# EAGLE design dmx-relay-puck (EAGLE 7.4.0)
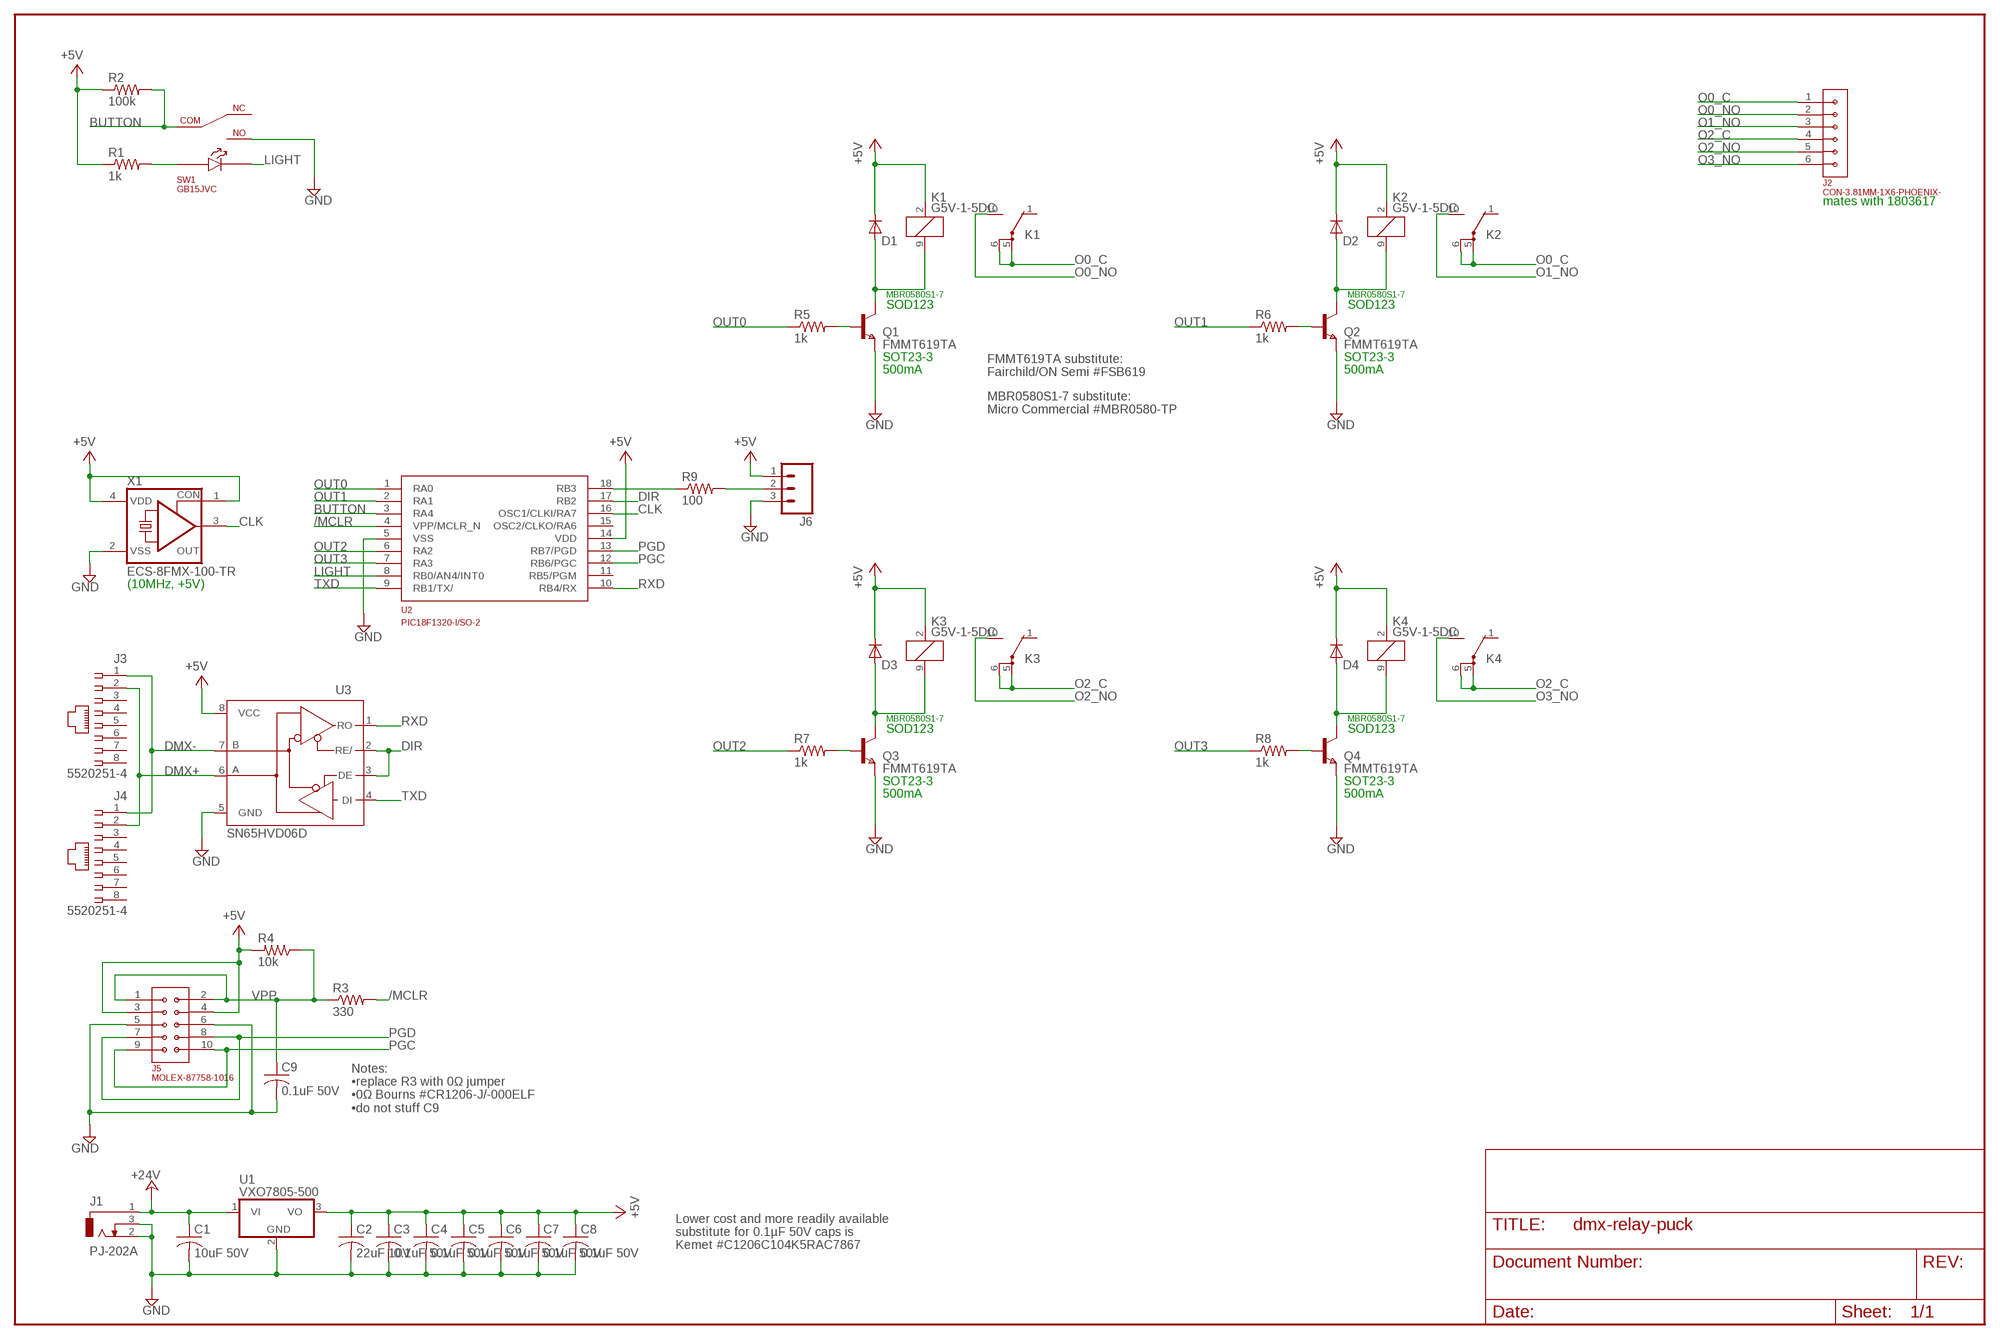
[diagram p0: schematic, sheet 1]

## Parts
C1  10uF 50V  C-USC1210K  [C1210K]
C2  22uF 10V  C-USC1206K  [C1206K]
C3  0.1uF 50V  C-USC1206K  [C1206K]
C4  0.1uF 50V  C-USC1206K  [C1206K]
C5  0.1uF 50V  C-USC1206K  [C1206K]
C6  0.1uF 50V  C-USC1206K  [C1206K]
C7  0.1uF 50V  C-USC1206K  [C1206K]
C8  0.1uF 50V  C-USC1206K  [C1206K]
C9  0.1uF 50V  C-USC1206K  [C1206K]
D1  1N4148W-TP  DIODE-SOD123  [SOD123]
D2  1N4148W-TP  DIODE-SOD123  [SOD123]
D3  1N4148W-TP  DIODE-SOD123  [SOD123]
D4  1N4148W-TP  DIODE-SOD123  [SOD123]
J1  PJ-202A  DCJ0202  [DCJ0202]
J2  CON-3.81MM-1X6-PHOENIX-  [CON-PHOENIX-3.81-1X6]
J3  5520251-4  520251-4  [520251-4]
J4  5520251-4  520251-4  [520251-4]
J5  MOLEX-87758-1016  CON-2MM-2X5-MOLEX-87758-1016  [CON-2MM-2X5]
J6  M03PTH  [1X03]
K1  G5V-1-5DC  G5V1  [G5V1]
K2  G5V-1-5DC  G5V1  [G5V1]
K3  G5V-1-5DC  G5V1  [G5V1]
K4  G5V-1-5DC  G5V1  [G5V1]
Q1  FMMT619TA  NPNSOT23  [SOT-23]
Q2  FMMT619TA  NPNSOT23  [SOT-23]
Q3  FMMT619TA  NPNSOT23  [SOT-23]
Q4  FMMT619TA  NPNSOT23  [SOT-23]
R1  1k  R-US_R1206  [R1206]
R2  100k  R-US_R1206  [R1206]
R3  330  R-US_R1206  [R1206]
R4  10k  R-US_R1206  [R1206]
R5  1k  R-US_R1206  [R1206]
R6  1k  R-US_R1206  [R1206]
R7  1k  R-US_R1206  [R1206]
R8  1k  R-US_R1206  [R1206]
R9  100  R-US_R1206  [R1206]
SW1  GB15JVC  GB15JHC  [GB15JHC]
U1  VXO7805-500  CUI-V7803-500  [CUI-78XX-500]
U2  PIC18F1320-I/SO-2  [SO18W]
U3  SN65HVD06D  MAX3468CSA  [SO08]
X1  ECS-8FMX-100-TR  CRYSTAL_RES-1100S  [1100S]

## Nets
+5V: C2.1 C3.1 C4.1 C5.1 C6.1 C7.1 C8.1 D1.C D2.C D3.C D4.C J5.3 J5.4 J6.1 K1.2 K2.2 K3.2 K4.2 R1.1 R2.1 R4.2 U1.3(VO) U2.14(VDD) U3.8(VCC) X1.1(CON) X1.4(VDD)
+24V: C1.1 J1.1 U1.1(VI)
/MCLR: R3.2 U2.4(VPP/MCLR_N)
BUTTON: R2.2 SW1.5 U2.3(RA4)
CLK: U2.16(OSC1/CLKI/RA7) X1.3(OUT)
DIR: U2.17(RB2) U3.2(RE/) U3.3(DE)
DMX+: J3.2 J4.2 U3.6(A)
DMX-: J3.1 J4.1 U3.7(B)
GND: C1.2 C2.2 C3.2 C4.2 C5.2 C6.2 C7.2 C8.2 C9.2 J1.2 J1.3 J5.5 J5.6 J6.3 Q1.2(E) Q2.2(E) Q3.2(E) Q4.2(E) SW1.4 U1.2(GND) U2.5(VSS) U3.5(GND) X1.2(VSS)
LIGHT: SW1.3 U2.8(RB0/AN4/INT0)
N$1: Q2.3(B) R6.2
N$2: D2.A K2.9 Q2.1(C)
N$3: Q3.3(B) R7.2
N$4: D3.A K3.9 Q3.1(C)
N$5: Q4.3(B) R8.2
N$6: D4.A K4.9 Q4.1(C)
N$8: R9.1 U2.18(RB3)
N$9: J6.2 R9.2
N$14: R1.2 SW1.1
N$16: Q1.3(B) R5.2
N$200: D1.A K1.9 Q1.1(C)
O0_C: J2.1 K1.5(2:P) K1.6(2:P) K2.5(2:P) K2.6(2:P)
O0_NO: J2.2 K1.10(2:S)
O1_NO: J2.3 K2.10(2:S)
O2_C: J2.4 K3.5(2:P) K3.6(2:P) K4.5(2:P) K4.6(2:P)
O2_NO: J2.5 K3.10(2:S)
O3_NO: J2.6 K4.10(2:S)
OUT0: R5.1 U2.1(RA0)
OUT1: R6.1 U2.2(RA1)
OUT2: R7.1 U2.6(RA2)
OUT3: R8.1 U2.7(RA3)
PGC: J5.9 J5.10 U2.12(RB6/PGC)
PGD: J5.7 J5.8 U2.13(RB7/PGD)
RXD: U2.10(RB4/RX) U3.1(RO)
TXD: U2.9(RB1/TX/) U3.4(DI)
VPP: C9.1 J5.1 J5.2 R3.1 R4.1
Unconnected: J3.3 J3.4 J3.5 J3.6 J3.7 J3.8 J4.3 J4.4 J4.5 J4.6 J4.7 J4.8 K1.1(2:O) K2.1(2:O) K3.1(2:O) K4.1(2:O) SW1.6 U2.11(RB5/PGM) U2.15(OSC2/CLKO/RA6)

## Notes on the sheet
- mates with 1803617
- MBR0580S1-7 | MBR0580S1-7
- SOD123 | SOD123
- SOT23-3 | SOT23-3
- 500mA | 500mA
- FMMT619TA substitute:
  Fairchild/ON Semi #FSB619
- MBR0580S1-7 substitute:
  Micro Commercial #MBR0580-TP
- (10MHz, +5V)
- MBR0580S1-7 | MBR0580S1-7
- SOD123 | SOD123
- SOT23-3 | SOT23-3
- 500mA | 500mA
- Notes:
  •replace R3 with 0Ω jumper
  •0Ω Bourns #CR1206-J/-000ELF
  •do not stuff C9
- Lower cost and more readily available
  substitute for 0.1µF 50V caps is
  Kemet #C1206C104K5RAC7867

## Library data of the parts
C1 = rcl:C-US: CAPACITOR, American symbol; MFR: KEMET; MFR_PART_NO: C1210C106K5RACTU
C2 = rcl:C-US: CAPACITOR, American symbol; MFR: KEMET; MFR_PART_NO: C1206C226K8RAC7800
C3-C9 = rcl:C-US: CAPACITOR, American symbol; MFR: KEMET; MFR_PART_NO: C1206S104M5RACTU
D1-D4 = diode:DIODE-: DIODE; MFR: DIODES INC; MFR_PART_NO: MBR0580S1-7
J1 = GlenPartsLibrary:DCJ0202: DC POWER JACK Source: DCJ0202.pdf; MFR: CUI; MFR_PART_NO: PJ-202A
J2 = 0GlenConnectors:CON-3.81MM-1X6-PHOENIX-; MFR: PHOENIX; MFR_PART_NO: 1803316
J3 J4 = con-amp:520251-4: AMP connector; MFR: TE; MFR_PART_NO: 5520251-4
J5 = 0GlenConnectors:CON-2MM-2X5-MOLEX-87758-1016; MFR: MOLEX; MFR_PART_NO: 87758-1016
J6 = SparkFun:M03: Header 3 Standard 3-pin 0.1" header. Use with straight break away headers (SKU : PRT-00116), right angle break away headers (PRT-00553), swiss pins (PRT-00743), machine pins (PRT-00117), and female headers (PRT-00115). Molex polarized connector foot print use with SKU : PRT-08232 with associated crimp pins and housings.; MFR: WURTH; MFR_PART_NO: 61300311121
K1-K4 = relay:G5V1: RELAY 1 x switch, 0.5 A/125 V AC, 1 A/24 V DC , Omron; MFR: OMRON; MFR_PART_NO: G5V-1-DC5; MPN: G5V-1-DC24; OC_FARNELL: 9949593; OC_NEWARK: 36M6377
Q1-Q4 = zetex:NPNSOT23: NPN TRANSISTOR; MFR: DIODES INC; MFR_PART_NO: FMMT619TA; MPN: DSS20201L-7; OC_FARNELL: 1710688; OC_NEWARK: 25R4555
R1 = rcl:R-US_: RESISTOR, American symbol; MFR: BOURNS; MFR_PART_NO: CR1206-JW-102GLF
R2 = rcl:R-US_: RESISTOR, American symbol; MFR: BOURNS; MFR_PART_NO: CR1206-JW-104GLF
R3 = rcl:R-US_: RESISTOR, American symbol; MFR: BOURNS; MFR_PART_NO: CR1206-JW-331ELF
R4 = rcl:R-US_: RESISTOR, American symbol; MFR: BOURNS; MFR_PART_NO: CR1206-JW-103GLF
R5-R8 = rcl:R-US_: RESISTOR, American symbol; MFR: BOURNS; MFR_PART_NO: CR1206-JW-102ELF
R9 = rcl:R-US_: RESISTOR, American symbol; MFR: BOURNS; MFR_PART_NO: CR1206-JW-101ELF
SW1 = GlenPartsLibrary:GB15JHC; MFR: NKK; MFR_PART_NO: GB15JVC
U1 = GlenPartsLibrary:CUI-V7803-500; MFR: CUI; MFR_PART_NO: VXO7805-500
U2 = GlenPartsLibrary:PIC18F1320-I/SO-2; MFR: MICROCHIP; MFR_PART_NO: PIC18F1320-I/SO
U3 = maxim:MAX34*: +5V, Fail-Safe, 40Mbps, Profibus RS-485/RS-422 Transceivers Source: MAX3465-MAX3469.pdf; MFR: TI; MFR_PART_NO: SN65HVD06D; MPN: MAX3468CSA+; OC_FARNELL: unknown; OC_NEWARK: 76K6721
X1 = crystal:CRYSTAL_RES-: CRYSTAL RESONATOR; MFR: ECS; MFR_PART_NO: ECS-8FMX-100-TR; OC_FARNELL: unknown; OC_NEWARK: unknown

## Board
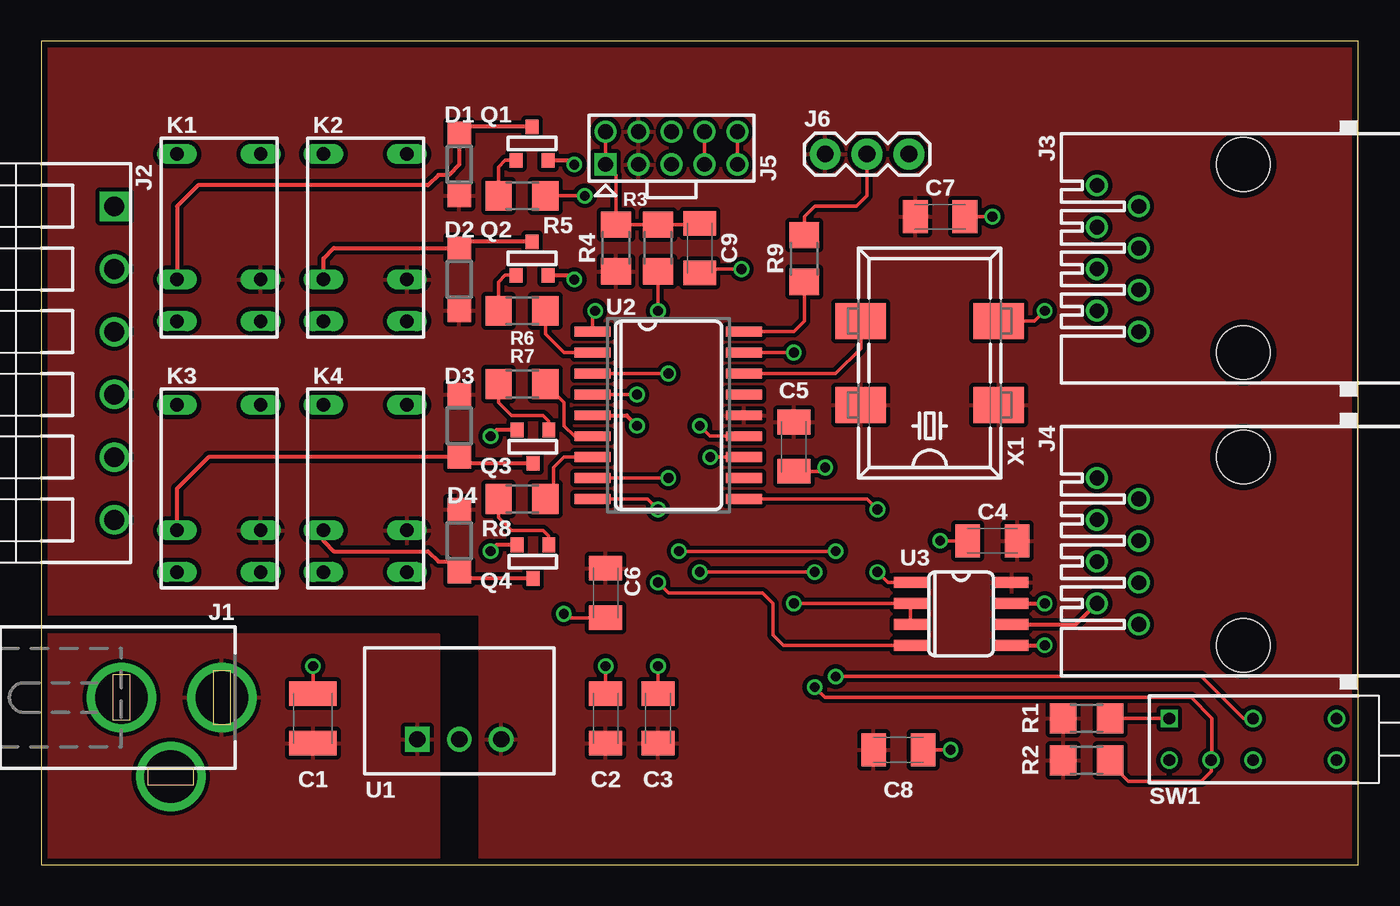
[diagram p1: board, top side]
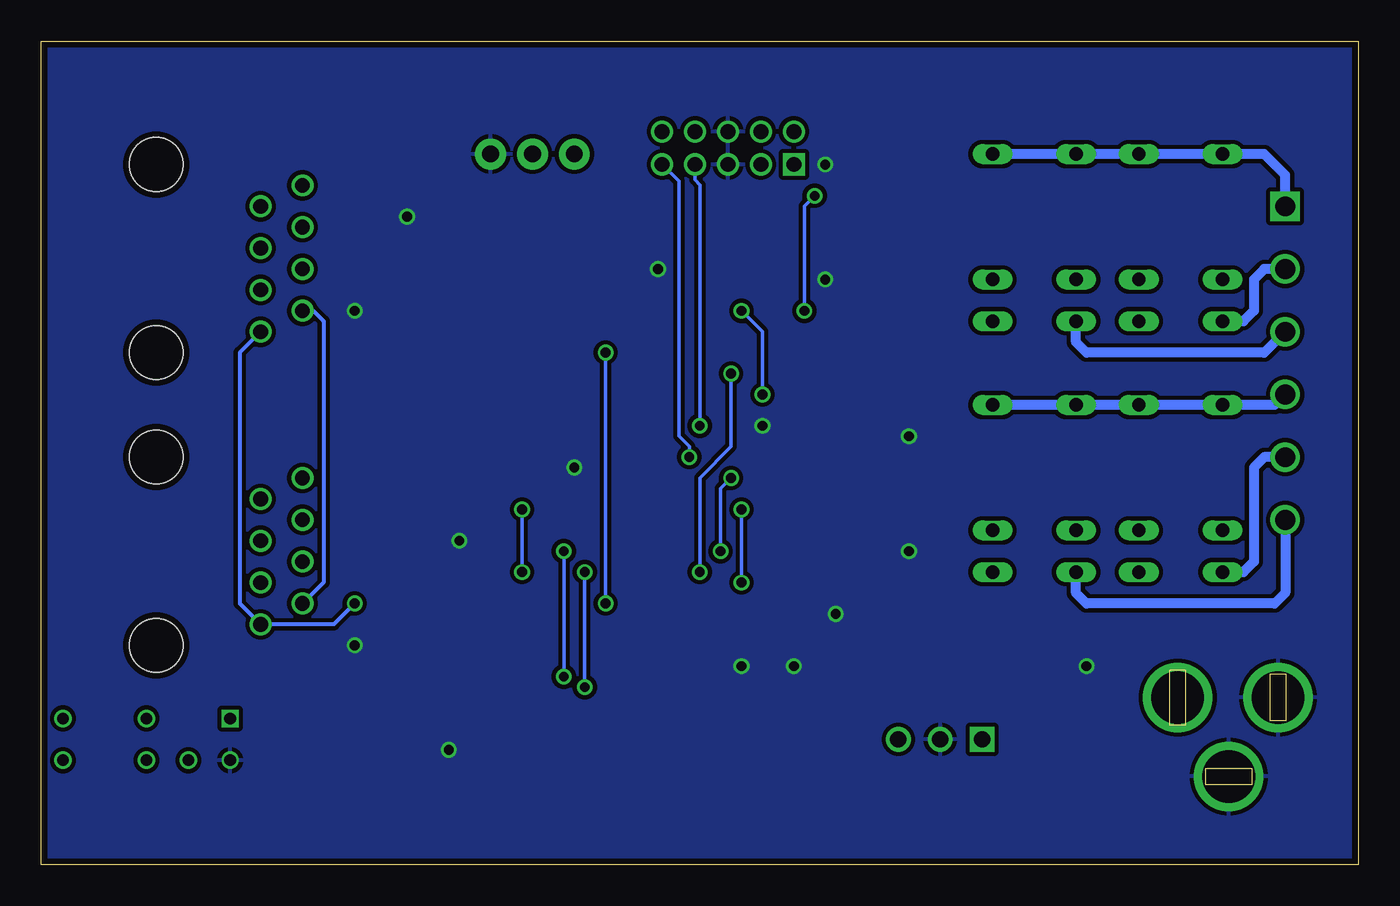
[diagram p2: board, bottom side, seen from below]

Size 80.01 x 50.04 mm. Coordinates in mm from the lower left corner, seen from the top.
Outline: 0,0 80.01,0 80.01,50.04 0,50.04 0,0
Copper layers (1*16): Top 0.0356mm / dielectric 1.5011mm / Bottom 0.0356mm
Design rules "LaenPCBOrder": minimum track width 6mil, minimum drill 13mil, track to track 6mil, track to pad 6mil, pad to pad 6mil, via to via 6mil, smd to smd 6mil, copper to edge 15mil, drill to drill 6mil, minimum pad ring 7mil, minimum via ring 7mil, stop-mask expansion 4mil, vias tented up to drill 0mil, thermal gap 10mil

### Footprints (pad centres in the part's own frame; a part is rotated, then mirrored left to right if it is on the bottom)
C1210K = smd 1.5 x 2.9: 1 -1.5,0; 2 1.5,0
C1206K = smd 1.5 x 2: 1 -1.5,0; 2 1.5,0
SOD123 = smd 1.4 x 1.4: A 1.9,0; C -1.9,0
DCJ0202 = drill 3.2 pad 4.064: 1 0,3.1; 2 0,-3; 3 4.8,0
CON-PHOENIX-3.81-1X6 = drill 1.2 square: 1 0,0 | drill 1.2: 2 3.81,0; 3 7.62,0; 4 11.43,0; 5 15.24,0; 6 19.05,0
520251-4 = drill 0.889: 1 -4.445,6.35; 2 -3.175,8.89; 3 -1.905,6.35; 4 -0.635,8.89; 5 0.635,6.35; 6 1.905,8.89; 7 3.175,6.35; 8 4.445,8.89 | hole 3.251: -5.715,0; 5.715,0
CON-2MM-2X5 = drill 0.9 pad 1.27 square: 1 0,0 | drill 0.9 pad 1.27: 2 2,0; 3 0,-2; 4 2,-2; 5 0,-4; 6 2,-4; 7 0,-6; 8 2,-6; 9 0,-8; 10 2,-8
1X03 = drill 1.016 pad 1.88: 1 0,0; 2 2.54,0; 3 5.08,0
G5V1 = drill 0.813 long: 1 -5.08,-2.54; 2 -2.54,-2.54; 5 5.08,-2.54; 6 5.08,2.54; 9 -2.54,2.54; 10 -5.08,2.54
SOT-23 = smd 0.787 x 0.889: 1 0.025,-1.016; 2 -0.94,1.016; 3 0.991,1.016
R1206 = smd 1.6 x 1.803: 1 -1.422,0; 2 1.422,0
GB15JHC = drill 0.7 square: 1 1.27,12.751 | drill 0.7: 3 1.27,7.671; 4 -1.27,12.751; 5 -1.27,10.211; 6 -1.27,7.671; NC.1 1.27,2.591; NC.2 -1.27,2.591
CUI-78XX-500 = drill 1 square: 1 0,0 | drill 1: 2 2.54,0; 3 5.08,0
SO18W = smd 0.6 x 2.2: 1 -4.445,-4.6; 2 -3.175,-4.6; 3 -1.905,-4.6; 4 -0.635,-4.6; 5 0.635,-4.6; 6 1.905,-4.6; 7 3.175,-4.6; 8 4.445,-4.6; 9 5.715,-4.6; 10 5.715,4.6; 11 4.445,4.6; 12 3.175,4.6; 13 1.905,4.6; 14 0.635,4.6; 15 -0.635,4.6; 16 -1.905,4.6; 17 -3.175,4.6; 18 -4.445,4.6
SO08 = smd 0.66 x 2.032: 1 -1.905,-3.073; 2 -0.635,-3.073; 3 0.635,-3.073; 4 1.905,-3.073; 5 1.905,3.073; 6 0.635,3.073; 7 -0.635,3.073; 8 -1.905,3.073
1100S = smd 2.184 x 3.048: 1 -2.54,-4.191; 2 2.54,-4.191; 3 2.54,4.191; 4 -2.54,4.191

### Placement (x,y rotation side)
C1  16.51,8.89 90 top
C2  34.29,8.89 90 top
C3  37.47,8.89 90 top
C4  57.78,19.68 180 top
C5  45.72,25.4 270 top
C6  34.29,16.51 270 top
C7  54.61,39.37 0 top
C8  52.07,6.99 0 top
C9  40.01,37.47 270 top
D1  25.4,42.55 90 top
D2  25.4,35.56 90 top
D3  25.4,26.67 270 top
D4  25.4,19.68 270 top
J1  7.87,10.16 270 top
J2  4.45,40.01 270 top
J3  73.03,36.83 90 top
J4  73.03,19.05 90 top
J5  34.29,42.55 90 top
J6  47.62,43.18 0 top
K1  10.79,38.1 90 top
K2  19.68,38.1 90 top
K3  10.79,22.86 90 top
K4  19.68,22.86 90 top
Q1  29.84,43.81 180 top
Q2  29.84,36.83 180 top
Q3  29.84,25.4 0 top
Q4  29.84,18.41 0 top
R1  63.5,8.89 0 top
R2  63.5,6.35 0 top
R3  37.47,37.47 270 top
R4  34.92,37.47 270 top
R5  29.21,40.64 180 top
R6  29.21,33.66 180 top
R7  29.21,29.21 180 top
R8  29.21,22.23 180 top
R9  46.35,36.83 90 top
SW1  81.28,7.62 90 top
U1  22.86,7.62 0 top
U2  38.1,27.94 270 top
U3  55.88,15.24 270 top
X1  53.98,30.48 90 top

### Tracks (layer width: path | path; a pad name or v marks a point on that pad's centre or on a via)
+5V
  pour Top (isolate 0.254): 26.67,0 26.67,15.24 0,15.24 0,50.04 80.01,50.04 80.01,0
+24V
  pour Top (isolate 0.254): 0,0 0,13.97 24.13,13.97 24.13,0
/MCLR  (via drill 0.6)
  Top 0.203: U2.4 v36.2,28.57 | v37.47,33.66 R3.2
  Bottom 0.203: v36.2,28.57 36.2,32.38 v37.47,33.66
BUTTON  (via drill 0.6)
  Top 0.203: U2.3 v38.1,29.84 | v40.01,17.78 v46.99,17.78 | v46.99,10.79 47.62,10.16 69.85,10.16 71.12,8.89 71.12,6.4 SW1.5 71.07,5.66 70.48,5.08 66.04,5.08 65.41,5.71 65.41,5.87 R2.2
  Bottom 0.203: v38.1,29.84 38.1,25.4 40.01,23.5 v40.01,17.78 | v46.99,17.78 v46.99,10.79
CLK
  Top 0.203: U2.16 48.26,29.84 49.78,31.37 X1.3
DIR  (via drill 0.6)
  Top 0.203: U3.3 U3.2 v45.72,15.88 | v45.72,31.11 U2.17
  Bottom 0.203: v45.72,15.88 v45.72,31.11
DMX+
  Top 0.254: U3.6 62.87,14.61 J4.2
  Bottom 0.254: J3.2 63.5,33.66 62.87,33.02 62.87,17.14 J4.2
DMX-  (via drill 0.6)
  Top 0.254: U3.7 v60.96,15.88
  Bottom 0.254: J3.1 67.94,31.11 67.94,15.88 J4.1 62.23,14.61 v60.96,15.88
GND  (via drill 0.6)
  Top 0.203: C5.2 47.4,23.9 v47.62,24.13 | C4.2 v54.61,19.68 | X1.2 60.33,33.02 v60.96,33.66 | C1.2 v16.51,12.06 | C2.2 v34.29,12.06 | C3.2 v37.47,12.06 | C9.2 40.01,36.2 v42.55,36.2 | C6.2 31.98,15.01 v31.75,15.24 | C7.2 v57.78,39.37 | C8.2 v55.24,6.99
  Top 0.254: U2.5 35.56,27.3 v36.2,26.67 | U3.5 v60.96,13.34 | Q1.2 32.13,42.8 v32.38,42.55 | Q2.2 32.13,35.81 v32.38,35.56 | Q3.2 27.69,26.42 v27.3,26.04 | Q4.2 27.69,19.43 v27.3,19.05
  pour Bottom (isolate 0.254): 0,0 80.01,0 80.01,50.04 0,50.04
LIGHT  (via drill 0.6)
  Top 0.203: U2.8 v38.1,23.5 | v38.73,19.05 v48.26,19.05 | SW1.3 73.03,8.89 70.48,11.43 v48.26,11.43
  Bottom 0.203: v38.1,23.5 38.73,22.86 v38.73,19.05 | v48.26,19.05 v48.26,11.43
N$1
  Top 0.203: R6.2 27.79,35.41 28.19,35.81 Q2.3
N$2
  Top 0.203: D2.A
  Top 0.254: Q2.1 25.79,37.85 D2.A | K2.9 17.14,36.83 17.78,37.47 D2.A
N$3
  Top 0.203: Q3.3 30.84,26.95 30.48,27.3 28.57,27.3 27.79,28.09 R7.2
N$4
  Top 0.254: Q3.1 25.79,24.38 D3.A 10.16,24.77 8.26,22.86 K3.9
N$5
  Top 0.203: Q4.3 30.84,19.96 30.48,20.32 28.57,20.32 27.79,21.11 R8.2
N$6
  Top 0.254: Q4.1 25.79,17.4 D4.A 24.77,18.41 24.13,18.41 23.5,19.05 17.78,19.05 17.14,19.68 K4.9
N$8
  Top 0.203: U2.18 45.72,32.38 46.35,33.02 R9.1
N$9
  Top 0.203: R9.2 46.35,39.37 46.99,40.01 49.53,40.01 50.16,40.64 J6.2
N$14
  Top 0.203: 68.58,8.89 SW1.1 R1.2
N$16
  Top 0.203: R5.2 27.79,42.39 28.19,42.8 Q1.3
N$200
  Top 0.203: 25.79,44.83 D1.A
  Top 0.254: Q1.1 25.79,44.83 | D1.A 25.4,42.55 24.77,41.91 24.13,41.91 23.5,41.27 9.53,41.27 8.26,40.01 K1.9
O0_C
  Bottom 0.61: J2.1 4.45,41.91 5.71,43.18 K1.6 K1.5 K2.6 K2.5
O0_NO
  Bottom 0.61: J2.2 5.71,36.2 6.35,35.56 6.35,33.66 6.99,33.02 K1.10
O1_NO
  Bottom 0.61: J2.3 5.71,31.11 16.51,31.11 17.14,31.75 K2.10
O2_C
  Bottom 0.61: J2.4 5.08,27.94 K3.6 K3.5 K4.6 K4.5
O2_NO
  Bottom 0.61: J2.5 5.71,24.77 6.35,24.13 6.35,18.41 6.99,17.78 K3.10
O3_NO
  Bottom 0.61: J2.6 4.45,16.51 5.08,15.88 16.51,15.88 17.14,16.51 K4.10
OUT0  (via drill 0.6)
  Top 0.203: U2.1 33.5,33.5 v33.66,33.66 | v33.02,40.64 R5.1
  Bottom 0.203: v33.66,33.66 33.66,40.01 v33.02,40.64
OUT1
  Top 0.203: U2.2 31.75,31.11 30.63,32.23 R6.1
OUT2
  Top 0.203: U2.6 32.38,26.04 31.75,26.67 31.75,28.09 R7.1
OUT3
  Top 0.203: U2.7 31.75,24.77 31.11,24.13 31.11,22.07 R8.1
PGC  (via drill 0.6)
  Top 0.203: J5.10 J5.9 | U2.12 v40.64,24.77
  Bottom 0.203: v40.64,24.77 40.64,25.4 41.27,26.04 41.27,41.53 J5.9
PGD  (via drill 0.6)
  Top 0.203: J5.8 J5.7 | v40.01,26.67 40.64,26.04 U2.13
  Bottom 0.203: J5.7 40.29,41.62 40.01,41.27 v40.01,26.67
RXD  (via drill 0.6)
  Top 0.203: U2.10 50.16,22.23 v50.8,21.59 | v50.8,17.78 51.44,17.14 U3.1
  Bottom 0.203: v50.8,21.59 v50.8,17.78
TXD  (via drill 0.6)
  Top 0.203: U2.9 36.83,22.23 v37.47,21.59 | v37.47,17.14 38.1,16.51 43.81,16.51 44.45,15.88 44.45,13.97 45.09,13.34 U3.4
  Bottom 0.203: v37.47,21.59 v37.47,17.14
VPP
  Top 0.203: J5.2 J5.1 34.92,41.91 R4.1 R3.1 39.29,38.89 C9.1

### Text on the board
_tsilk: D1 | Q1 | J6 | K1 | K2 | J3 | J2 | J5 | C7 | R3 | R5 | D2 | Q2 | R4 | C9 | R9 | U2 | R6 | R7 | K3 | K4 | D3 | C5 | J4 | Q3 | X1 | D4 | R8 | C4 | Q4 | C6 | U3 | J1 | R1 | C1 | C2 | C3 | R2 | U1 | C8 | SW1